# EAGLE design A601E (EAGLE 6.6.0)
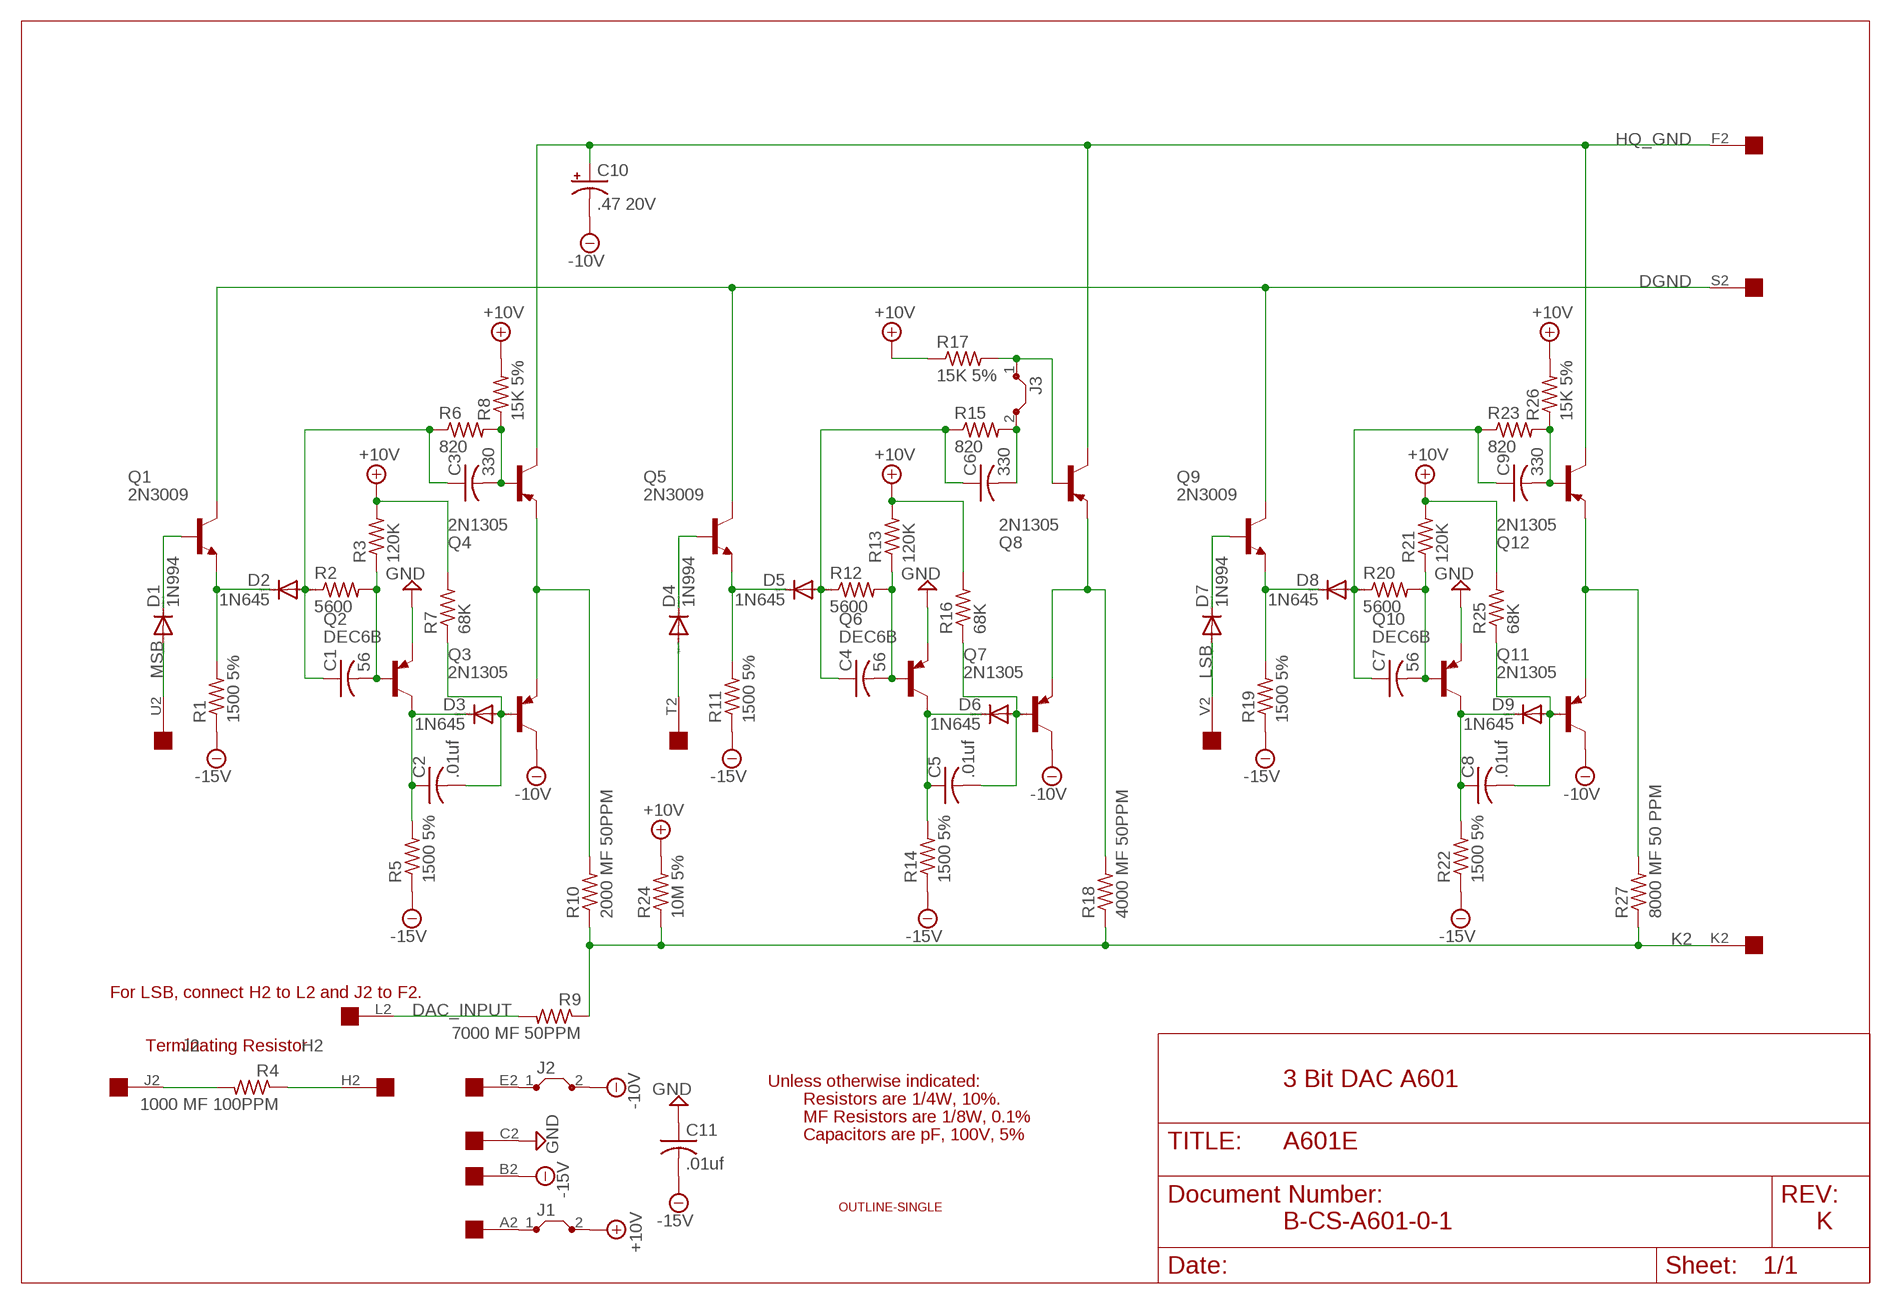
[diagram p0: schematic, sheet 1]

## Parts
C1  56  C-US075-032X103  [C075-032X103]
C2  .01uf  C-US050-025X075  [C050-025X075]
C3  330  C-US075-032X103  [C075-032X103]
C4  56  C-US075-032X103  [C075-032X103]
C5  .01uf  C-US050-025X075  [C050-025X075]
C6  330  C-US075-032X103  [C075-032X103]
C7  56  C-US075-032X103  [C075-032X103]
C8  .01uf  C-US050-025X075  [C050-025X075]
C9  330  C-US075-032X103  [C075-032X103]
C10  .47 20V  CPOL-USE22-6AXIAL  [E22-6]
C11  .01uf  C-US050-025X075  [C050-025X075]
D1  1N994  1N4148DO35-10  [DO35-10]
D2  1N645  1N4148DO35-10  [DO35-10]
D3  1N645  1N4148DO35-10  [DO35-10]
D4  1N994  1N4148DO35-10  [DO35-10]
D5  1N645  1N4148DO35-10  [DO35-10]
D6  1N645  1N4148DO35-10  [DO35-10]
D7  1N994  1N4148DO35-10  [DO35-10]
D8  1N645  1N4148DO35-10  [DO35-10]
D9  1N645  1N4148DO35-10  [DO35-10]
J1  J10MM  [10]
J2  J10MM  [10]
J3  J10MM  [10]
Q1  2N3009  2N1613-NPN-TO39-EBC  [TO39]
Q2  DEC6B  2N2904A  [TO39]
Q3  2N1305  2N2904A  [TO39]
Q4  2N1305  2N2904A  [TO39]
Q5  2N3009  2N1613-NPN-TO39-EBC  [TO39]
Q6  DEC6B  2N2904A  [TO39]
Q7  2N1305  2N2904A  [TO39]
Q8  2N1305  2N2904A  [TO39]
Q9  2N3009  2N1613-NPN-TO39-EBC  [TO39]
Q10  DEC6B  2N2904A  [TO39]
Q11  2N1305  2N2904A  [TO39]
Q12  2N1305  2N2904A  [TO39]
R1  1500 5%  R-US_0207/10  [0207/10]
R2  5600  R-US_0207/10  [0207/10]
R3  120K  R-US_0207/10  [0207/10]
R4  1000 MF 100PPM  R-US_0309/12  [0309/12]
R5  1500 5%  R-US_0207/10  [0207/10]
R6  820  R-US_0207/10  [0207/10]
R7  68K  R-US_0207/10  [0207/10]
R8  15K 5%  R-US_0207/10  [0207/10]
R9  7000 MF 50PPM  R-US_0309/12  [0309/12]
R10  2000 MF 50PPM  R-US_0309/12  [0309/12]
R11  1500 5%  R-US_0207/10  [0207/10]
R12  5600  R-US_0207/10  [0207/10]
R13  120K  R-US_0207/10  [0207/10]
R14  1500 5%  R-US_0207/10  [0207/10]
R15  820  R-US_0207/10  [0207/10]
R16  68K  R-US_0207/10  [0207/10]
R17  15K 5%  R-US_0207/10  [0207/10]
R18  4000 MF 50PPM  R-US_0309/12  [0309/12]
R19  1500 5%  R-US_0207/10  [0207/10]
R20  5600  R-US_0207/10  [0207/10]
R21  120K  R-US_0207/10  [0207/10]
R22  1500 5%  R-US_0207/10  [0207/10]
R23  820  R-US_0207/10  [0207/10]
R24  10M 5%  R-US_0207/10  [0207/10]
R25  68K  R-US_0207/10  [0207/10]
R26  15K 5%  R-US_0207/10  [0207/10]
R27  8000 MF 50 PPM  R-US_0309/12  [0309/12]
U$1  OUTLINE-SINGLE  [SINGLE]
U$3  EDGE-1  [EDGE-CON1]

## Nets
+10V [supply]: J1.2 R3.2 R7.2 R8.2 R13.2 R16.2 R17.1 R21.2 R24.2 R25.2 R26.2
-10V [supply]: C10.- J2.2 Q3.3(C) Q7.3(C) Q11.3(C)
-15V [supply]: C11.2 R1.1 R5.1 R11.1 R14.1 R19.1 R22.1 U$3.B2
DAC_INPUT: R9.2 U$3.L2
DGND: Q1.3(C) Q5.3(C) Q9.3(C) U$3.S2
GND [supply]: C11.1 Q2.1(E) Q6.1(E) Q10.1(E) U$3.C2
H2: R4.1 U$3.H2
HQ_GND: C10.+ Q4.3(C) Q8.3(C) Q12.3(C) U$3.F2
J2: R4.2 U$3.J2
K2: R9.1 R10.1 R18.1 R24.1 R27.1 U$3.K2
LSB: D7.A U$3.V2
MSB: D1.A U$3.U2
N$1: D1.C Q1.2(B)
N$2: D2.C Q1.1(E) R1.2
N$3: C1.1 C3.1 D2.A R2.1 R6.1
N$4: C1.2 Q2.2(B) R2.2 R3.1
N$5: C3.2 Q4.2(B) R6.2 R8.1
N$6: C2.1 D3.C Q2.3(C) R5.2
N$7: C2.2 D3.A Q3.2(B) R7.1
N$8: Q3.1(E) Q4.1(E) R10.2
N$9 [supply]: J2.1 U$3.E2
N$10: D4.C Q5.2(B)
N$11: D5.C Q5.1(E) R11.2
N$12: C4.1 C6.1 D5.A R12.1 R15.1
N$13: C4.2 Q6.2(B) R12.2 R13.1
N$14: C6.2 J3.2 R15.2
N$15: C5.1 D6.C Q6.3(C) R14.2
N$16: C5.2 D6.A Q7.2(B) R16.1
N$17: Q7.1(E) Q8.1(E) R18.2
N$18: D7.C Q9.2(B)
N$19: D8.C Q9.1(E) R19.2
N$20: C7.1 C9.1 D8.A R20.1 R23.1
N$21: C7.2 Q10.2(B) R20.2 R21.1
N$22: C9.2 Q12.2(B) R23.2 R26.1
N$23: C8.1 D9.C Q10.3(C) R22.2
N$24: C8.2 D9.A Q11.2(B) R25.1
N$25: Q11.1(E) Q12.1(E) R27.2
N$26 [supply]: J1.1 U$3.A2
N$27: J3.1 Q8.2(B) R17.2
T2: D4.A U$3.T2
Unconnected: U$3.D2 U$3.M2 U$3.N2 U$3.P2 U$3.R2

## Notes on the sheet
- For LSB, connect H2 to L2 and J2 to F2.
- Terminating Resistor
- Unless otherwise indicated: | 3 Bit DAC A601
- Resistors are 1/4W, 10%.
- MF Resistors are 1/8W, 0.1%
- Capacitors are pF, 100V, 5%
- B-CS-A601-0-1 | K

## Library data of the parts
C1-C9 C11 = rcl:C-US: CAPACITOR, American symbol
C10 = rcl:CPOL-US: POLARIZED CAPACITOR, American symbol
D1-D9 = diode:1N4148: DIODE high speed (Philips)
J1-J3 = jumper:J: Bridge
Q1 Q5 Q9 = transistor:*-NPN-: NPN Transistror BF959 corrected 2008.03.06
Q2-Q4 Q6-Q8 Q10-Q12 = transistor-pnp:2N2904*: PNP Transistror
R1-R27 = rcl:R-US_: RESISTOR, American symbol
U$1 = dec-con:OUTLINE-*: Board outlines for DEC boards.
U$3 = dec-con:EDGE-1: Single-Sided DEC Edge Connector -- (side 2)

## Net classes
1 supply: width 0.813 mm

## Board
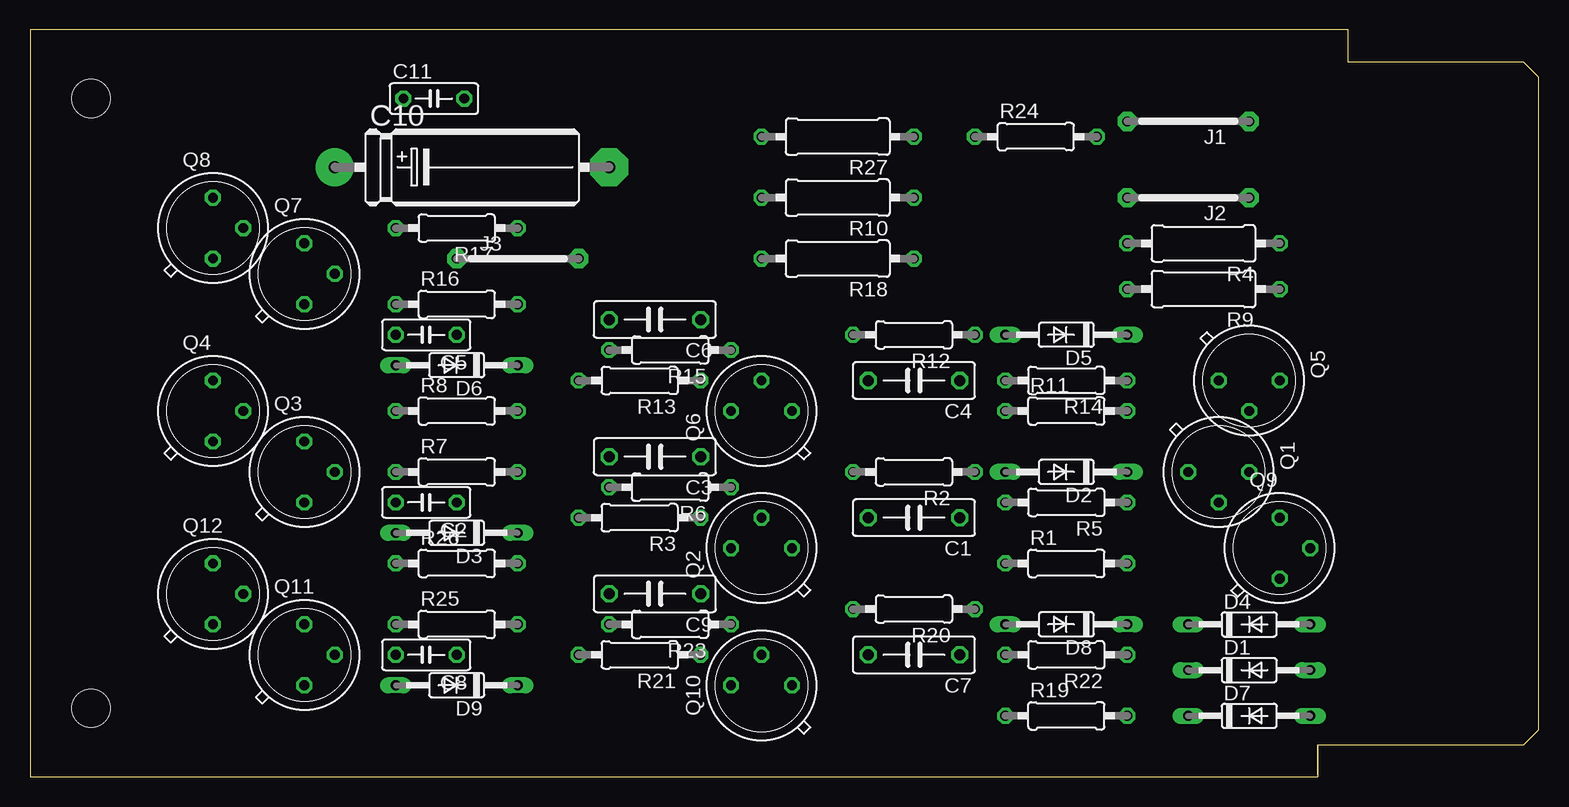
[diagram p1: board, top side]
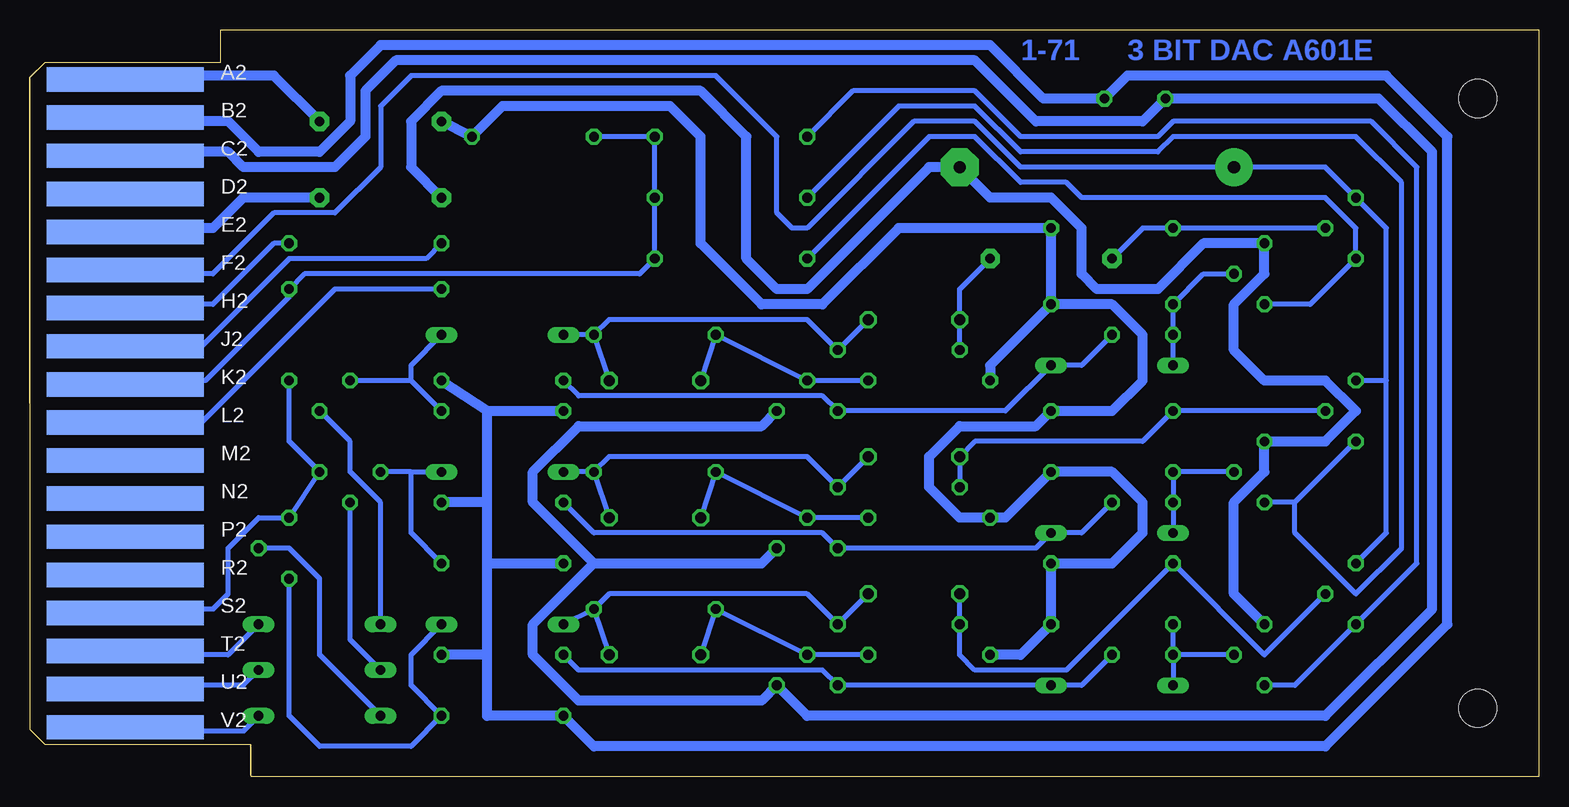
[diagram p2: board, bottom side, seen from below]

Size 125.73 x 62.23 mm. Coordinates in mm from the lower left corner, seen from the top.
Copper layers (1+16): Top 0.035mm / dielectric 1.5mm / Bottom 0.035mm
Design rules "16mils": minimum track width 16mil, minimum drill 32mil, track to track 15mil, track to pad 10mil, pad to pad 10mil, via to via 10mil, smd to smd 10mil, copper to edge 13mil, drill to drill 10mil, minimum pad ring 10mil, minimum via ring 8mil, stop-mask expansion 0mil, vias tented up to drill 0mil, thermal gap 10mil

### Footprints (pad centres in the part's own frame; a part is rotated, then mirrored left to right if it is on the bottom)
C075-032X103 = drill 0.914 octagon: 1 -3.81,0; 2 3.81,0
C050-025X075 = drill 0.813 octagon: 1 -2.54,0; 2 2.54,0
E22-6 = drill 1.016 pad 3.15: + -11.43,0 | drill 1.016 pad 3.15 octagon: - 11.43,0
DO35-10 = drill 0.813 long: A 5.08,0; C -5.08,0
10 = drill 0.813 pad 1.6 octagon: 1 -5.08,0; 2 5.08,0
TO39 = drill 0.813 octagon: 1 0,-2.54; 2 2.54,0; 3 0,2.54
0207/10 = drill 0.813 octagon: 1 -5.08,0; 2 5.08,0
0309/12 = drill 0.813 octagon: 1 -6.35,0; 2 6.35,0
SINGLE = hole 3.175: 120.65,56.515; 120.65,5.715
EDGE-CON1 = smd 13.106 x 2.032 bottom: A2 7.938,4.128; B2 7.938,7.303; C2 7.938,10.477; D2 7.938,13.652; E2 7.938,16.828; F2 7.938,20.003; H2 7.938,23.177; J2 7.938,26.352; K2 7.938,29.527; L2 7.938,32.703; M2 7.938,35.877; N2 7.938,39.053; P2 7.938,42.227; R2 7.938,45.403; S2 7.938,48.578; T2 7.938,51.752; U2 7.938,54.928; V2 7.938,58.102

### Placement (x,y rotation side)
C1  73.66,21.59 180 top
C2  33.02,22.86 180 top
C3  52.07,26.67 180 top
C4  73.66,33.02 180 top
C5  33.02,36.83 180 top
C6  52.07,38.1 180 top
C7  73.66,10.16 180 top
C8  33.02,10.16 180 top
C9  52.07,15.24 180 top
C10  36.83,50.8 0 top
C11  33.66,56.52 0 top
D1  101.6,8.89 0 top
D2  86.36,25.4 180 top
D3  35.56,20.32 180 top
D4  101.6,12.7 0 top
D5  86.36,36.83 180 top
D6  35.56,34.29 180 top
D7  101.6,5.08 0 top
D8  86.36,12.7 180 top
D9  35.56,7.62 180 top
J1  96.52,54.61 180 top
J2  96.52,48.26 180 top
J3  40.64,43.18 0 top
Q1  99.06,25.4 270 top
Q2  60.96,19.05 90 top
Q3  22.86,25.4 0 top
Q4  15.24,30.48 0 top
Q5  101.6,33.02 270 top
Q6  60.96,30.48 90 top
Q7  22.86,41.91 0 top
Q8  15.24,45.72 0 top
Q9  104.14,19.05 0 top
Q10  60.96,7.62 90 top
Q11  22.86,10.16 0 top
Q12  15.24,15.24 0 top
R1  86.36,17.78 0 top
R2  73.66,25.4 180 top
R3  50.8,21.59 180 top
R4  97.79,44.45 180 top
R5  86.36,22.86 180 top
R6  53.34,24.13 180 top
R7  35.56,25.4 0 top
R8  35.56,30.48 0 top
R9  97.79,40.64 180 top
R10  67.31,48.26 180 top
R11  86.36,30.48 0 top
R12  73.66,36.83 180 top
R13  50.8,33.02 180 top
R14  86.36,33.02 180 top
R15  53.34,35.56 180 top
R16  35.56,39.37 0 top
R17  35.56,45.72 180 top
R18  67.31,43.18 180 top
R19  86.36,5.08 0 top
R20  73.66,13.97 180 top
R21  50.8,10.16 180 top
R22  86.36,10.16 180 top
R23  53.34,12.7 180 top
R24  83.82,53.34 0 top
R25  35.56,12.7 0 top
R26  35.56,17.78 0 top
R27  67.31,53.34 180 top
U$1  125.73,62.23 180 top
U$3  125.73,62.23 180 top

### Tracks (layer width: path | path; a pad name or v marks a point on that pad's centre or on a via)
+10V
  Bottom 0.813: J1.2 R24.2 86.36,55.88 72.39,55.88 69.85,53.34 69.85,44.45 64.77,39.37 59.69,39.37 53.34,45.72 R17.1 R16.2 | R21.2 43.18,10.16 R25.2 R26.2 35.56,17.78 33.02,20.32 33.02,22.86 35.56,25.4 R7.2 44.45,21.59 R3.2 48.26,21.59 50.8,24.13 50.8,26.67 48.26,29.21 41.91,29.21 R8.2 35.56,30.48 33.02,33.02 33.02,36.83 35.56,39.37 R16.2 | R13.2 45.72,34.29 R16.2
-10V
  Bottom 0.813: J2.2 93.98,50.8 93.98,54.61 91.44,57.15 69.85,57.15 66.04,53.34 66.04,43.18 63.5,40.64 60.96,40.64 50.8,50.8 C10.- 45.72,48.26 40.64,48.26 38.1,45.72 38.1,41.91 36.83,40.64 31.75,40.64 27.94,44.45 Q7.3 22.86,41.91 25.4,39.37 25.4,35.56 22.86,33.02 17.78,33.02 15.24,30.48 17.78,27.94 Q3.3 22.86,25.4 25.4,22.86 25.4,15.24 Q11.3
-15V
  Bottom 0.813: 87.63,30.48 R11.1 | 87.63,30.48 R14.1 | 87.63,17.78 R1.1 | 87.63,17.78 87.63,22.86 R5.1 | 87.63,5.08 R19.1 78.74,2.54 17.78,2.54 7.62,12.7 7.62,53.34 12.7,58.42 34.29,58.42 C11.2 41.27,56.52 45.72,60.96 96.52,60.96 99.06,58.42 99.06,54.61 101.6,52.07 106.68,52.07 109.22,54.61 116.84,54.61 117.13,54.9 U$3.B2 | 87.63,5.08 87.63,10.16 R22.1 | 87.63,17.78 87.63,30.48 | 87.63,5.08 87.63,17.78
DAC_INPUT
  Bottom 0.406: U$3.L2 117.17,29.54 116.84,29.21 111.76,29.21 100.33,40.64 R9.2
DGND
  Bottom 0.406: U$3.S2 117.14,13.66 116.84,13.97 110.49,13.97 109.22,15.24 109.22,19.05 106.68,21.59 Q9.3 Q1.3 104.14,27.94 Q5.3
GND
  Bottom 0.813: U$3.C2 117.17,51.74 116.84,52.07 109.22,52.07 107.95,50.8 100.33,50.8 97.79,53.34 97.79,57.15 95.25,59.69 46.99,59.69 41.91,54.61 33.02,54.61 C11.1 13.34,56.52 8.89,52.07 8.89,13.97 17.78,5.08 60.96,5.08 Q10.1 64.77,6.35 80.01,6.35 83.82,10.16 83.82,12.7 78.74,17.78 | 78.74,17.78 64.77,17.78 Q2.1 | 78.74,17.78 83.82,22.86 83.82,25.4 80.01,29.21 64.77,29.21 Q6.1
H2
  Bottom 0.406: U$3.H2 117.17,39.04 116.84,39.37 110.49,39.37 105.41,44.45 R4.1
HQ_GND
  Bottom 0.406: U$3.F2 117.12,42.19 116.84,41.91 110.49,41.91 105.41,46.99 100.33,46.99 96.52,50.8 96.52,55.88 93.98,58.42 68.58,58.42 63.5,53.34 63.5,46.99 62.23,45.72 60.96,45.72 52.07,54.61 46.99,54.61 43.18,50.8 C10.+ 17.78,50.8 Q8.3 12.7,45.72 12.7,33.02 | 12.7,33.02 Q4.3 | Q12.3 12.7,20.32 12.7,33.02
J2
  Bottom 0.406: U$3.J2 117.17,35.89 116.84,35.56 111.76,35.56 104.14,43.18 92.71,43.18 R4.2
K2
  Bottom 0.406: R24.1 R27.1 R10.1 R18.1 74.93,41.91 102.87,41.91 R9.1 104.14,40.01 111.12,33.02 116.84,33.02 117.14,32.72 U$3.K2
LSB
  Bottom 0.406: U$3.V2 117.16,4.13 116.84,3.81 107.95,3.81 D7.A
MSB
  Bottom 0.406: U$3.U2 117.2,7.26 116.84,7.62 107.95,7.62 D1.A
N$1
  Bottom 0.406: D1.C 99.06,11.43 Q1.2
N$2
  Bottom 0.406: R1.2 93.98,20.32 93.98,25.4 | 93.98,25.4 D2.C | 93.98,25.4 Q1.1
N$3
  Bottom 0.406: R2.1 D2.A | R2.1 C1.1 | R6.1 C3.1 R6.1 | R6.1 60.96,26.67 77.47,26.67 R2.1
N$4
  Bottom 0.406: C1.2 R2.2 Q2.2 R3.1
N$5
  Bottom 0.406: R6.2 C3.2 46.99,27.94 33.02,27.94 R8.1 Q4.2
N$6
  Bottom 0.406: R5.2 78.74,20.32 59.69,20.32 Q2.3 41.91,19.05 D3.C 38.1,20.32 C2.1
N$7
  Bottom 0.406: D3.A C2.2 R7.1 Q3.2
N$8
  Bottom 0.406: R10.2 53.34,55.88 46.99,55.88 43.18,52.07 31.75,52.07 30.48,53.34 15.24,53.34 11.43,49.53 11.43,19.05 15.24,15.24 20.32,20.32 20.32,22.86 | 20.32,22.86 Q3.1 | 20.32,22.86 Q4.1
N$9
  Bottom 0.813: U$3.E2 117.17,45.39 116.84,45.72 110.49,45.72 107.95,48.26 J2.1
N$10
  Bottom 0.406: D4.C 96.52,22.86 99.06,25.4 99.06,27.94 Q5.2
N$11
  Bottom 0.406: 93.98,33.02 93.98,34.29 D5.C | R11.2 93.98,33.02 | 93.98,33.02 Q5.1
N$12
  Bottom 0.406: R12.1 D5.A | R12.1 C4.1 | R15.1 C6.1 R15.1 | R15.1 60.96,38.1 77.47,38.1 R12.1
N$13
  Bottom 0.406: C4.2 R12.2 Q6.2 R13.1
N$14
  Bottom 0.406: R15.2 C6.2 48.26,40.64 J3.2
N$15
  Bottom 0.406: R14.2 80.01,31.75 59.69,31.75 Q6.3 44.45,30.48 D6.C 38.1,34.29 C5.1
N$16
  Bottom 0.406: Q7.2 27.94,41.91 R16.1 C5.2 D6.A
N$17
  Bottom 0.406: Q7.1 19.05,39.37 Q8.1 15.24,45.72 17.78,48.26 38.1,48.26 39.37,49.53 43.18,49.53 46.99,53.34 50.8,53.34 R18.2
N$18
  Bottom 0.406: D7.C 101.6,10.16 101.6,16.51 104.14,19.05 Q9.2
N$19
  Bottom 0.406: Q9.1 104.14,5.08 101.6,2.54 93.98,2.54 R19.2 93.98,7.62 93.98,10.16 D8.C
N$20
  Bottom 0.406: R20.1 D8.A | R20.1 C7.1 | R23.1 C9.1 R23.1 | R23.1 60.96,15.24 77.47,15.24 R20.1
N$21
  Bottom 0.406: C7.2 R20.2 Q10.2 R21.1
N$22
  Bottom 0.406: C9.2 R23.2 48.26,10.16 46.99,8.89 39.37,8.89 R26.1 22.86,10.16 Q12.2
N$23
  Bottom 0.406: R22.2 80.01,8.89 59.69,8.89 Q10.3 D9.C 38.1,7.62 C8.1
N$24
  Bottom 0.406: Q11.2 C8.2 | C8.2 D9.A | C8.2 R25.1
N$25
  Bottom 0.406: Q11.1 20.32,7.62 Q12.1 10.16,17.78 10.16,50.8 13.97,54.61 30.48,54.61 31.75,53.34 43.18,53.34 46.99,57.15 57.15,57.15 R27.2
N$26
  Bottom 0.813: U$3.A2 117.22,58.04 116.84,58.42 105.41,58.42 J1.1
N$27
  Bottom 0.406: Q8.2 R17.2 33.02,45.72 J3.1
T2
  Bottom 0.406: U$3.T2 117.17,10.49 116.84,10.16 109.22,10.16 D4.A

### Text on the board
Bottom: 3 BIT DAC A601E | 1-71